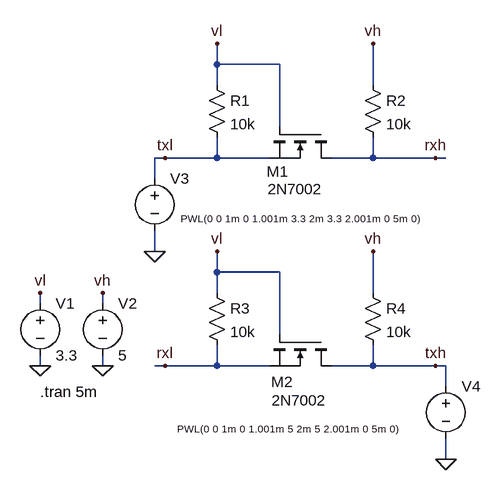
[diagram p0: schematic 01-2n7002_level_shifter.asc]
01-2n7002_level_shifter.asc, the LTspice schematic file:
Version 4
SHEET 1 1108 744
WIRE 208 -16 208 -48
WIRE 304 -16 208 -16
WIRE 208 16 208 -16
WIRE 448 16 448 -48
WIRE 304 80 304 -16
WIRE 128 128 112 128
WIRE 208 128 208 96
WIRE 208 128 128 128
WIRE 288 128 208 128
WIRE 448 128 448 96
WIRE 448 128 384 128
WIRE 544 128 448 128
WIRE 560 128 544 128
WIRE 112 160 112 128
WIRE 112 272 112 240
WIRE 208 304 208 272
WIRE 304 304 208 304
WIRE 208 336 208 304
WIRE 448 336 448 272
WIRE -64 352 -64 336
WIRE 32 352 32 336
WIRE 304 400 304 304
WIRE -64 448 -64 432
WIRE 32 448 32 432
WIRE 128 448 112 448
WIRE 208 448 208 416
WIRE 208 448 128 448
WIRE 288 448 208 448
WIRE 448 448 448 416
WIRE 448 448 384 448
WIRE 544 448 448 448
WIRE 560 448 544 448
WIRE 560 480 560 448
WIRE 560 592 560 560
FLAG -64 448 0
FLAG 32 448 0
FLAG -64 336 vl
FLAG 32 336 vh
FLAG 448 -48 vh
FLAG 208 -48 vl
FLAG 112 272 0
FLAG 128 128 txl
FLAG 544 128 rxh
FLAG 448 272 vh
FLAG 208 272 vl
FLAG 560 592 0
FLAG 544 448 txh
FLAG 128 448 rxl
SYMBOL res 192 0 R0
SYMATTR InstName R1
SYMATTR Value 10k
SYMBOL res 432 0 R0
SYMATTR InstName R2
SYMATTR Value 10k
SYMBOL nmos 384 80 R90
WINDOW 0 69 66 VRight 2
WINDOW 3 96 13 VRight 2
SYMATTR InstName M1
SYMATTR Value 2N7002
SYMBOL voltage -64 336 R0
WINDOW 123 0 0 Left 0
WINDOW 39 0 0 Left 0
SYMATTR InstName V1
SYMATTR Value 3.3
SYMBOL voltage 32 336 R0
WINDOW 123 0 0 Left 0
WINDOW 39 0 0 Left 0
SYMATTR InstName V2
SYMATTR Value 5
SYMBOL voltage 112 144 R0
WINDOW 3 40 77 Left 1
WINDOW 123 0 0 Left 0
WINDOW 39 0 0 Left 0
SYMATTR InstName V3
SYMATTR Value PWL(0 0 1m 0 1.001m 3.3 2m 3.3 2.001m 0 5m 0)
SYMBOL res 192 320 R0
SYMATTR InstName R3
SYMATTR Value 10k
SYMBOL res 432 320 R0
SYMATTR InstName R4
SYMATTR Value 10k
SYMBOL nmos 384 400 R90
WINDOW 0 73 59 VRight 2
WINDOW 3 101 7 VRight 2
SYMATTR InstName M2
SYMATTR Value 2N7002
SYMBOL voltage 560 464 R0
WINDOW 3 -413 81 Left 1
WINDOW 123 0 0 Left 0
WINDOW 39 0 0 Left 0
SYMATTR InstName V4
SYMATTR Value PWL(0 0 1m 0 1.001m 5 2m 5 2.001m 0 5m 0)
TEXT -64 488 Left 2 !.tran 5m

The netlist it stands for:
* 01-2n7002_level_shifter.asc
R1 vl txl 10k
R2 vh rxh 10k
M1 rxh vl txl txl 2N7002
V1 vl 0 3.3
V2 vh 0 5
V3 txl 0 PWL(0 0 1m 0 1.001m 3.3 2m 3.3 2.001m 0 5m 0)
R3 vl rxl 10k
R4 vh txh 10k
M2 txh vl rxl rxl 2N7002
V4 txh 0 PWL(0 0 1m 0 1.001m 5 2m 5 2.001m 0 5m 0)
.model NMOS NMOS
.model PMOS PMOS
.lib standard.mos
.tran 5m
.backanno
.end

* Results of the author's LTspice run, read from the files saved beside the schematic
* Operating Point, zero values left out:
*   V(vl) = 3.3 V
*   V(vh) = 5 V
*   V(rxh) = 1.759 mV
*   V(rxl) = 1.161 mV
*   Id(M1) = 499.8 µA
*   Is(M1) = -499.8 µA
*   Id(M2) = -329.9 µA
*   Is(M2) = 329.9 µA
*   I(R1) = 330 µA
*   I(R2) = 499.8 µA
*   I(R3) = 329.9 µA
*   I(R4) = 500 µA
*   I(V1) = -659.9 µA
*   I(V2) = -999.8 µA
*   I(V3) = 829.8 µA
*   I(V4) = 829.9 µA
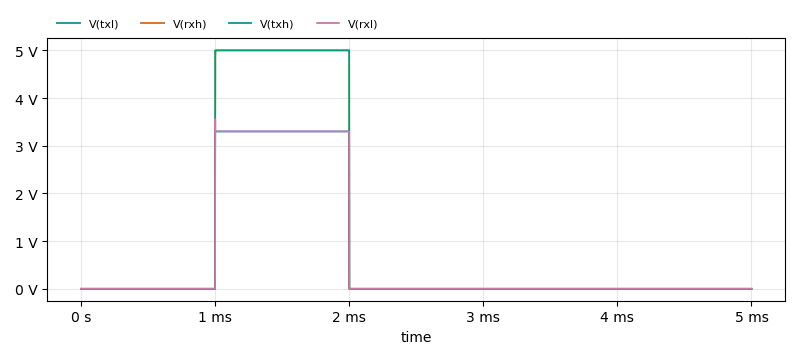
[diagram p1: Transient Analysis of 01-2n7002_level_shifter.asc, plotted from the saved traces]
* Transient Analysis, 1 run:
*   V(txl): min 0 V, max 3.3 V, average 660 mV, rms 1.476 V, last 0 V
*   V(rxh): min 1.755 mV, max 5 V, average 1.001 V, rms 2.235 V, last 1.759 mV
*   V(txh): min 0 V, max 5 V, average 1 V, rms 2.236 V, last 0 V
*   V(rxl): min 1.16 mV, max 3.56 V, average 661.2 mV, rms 1.476 V, last 1.161 mV